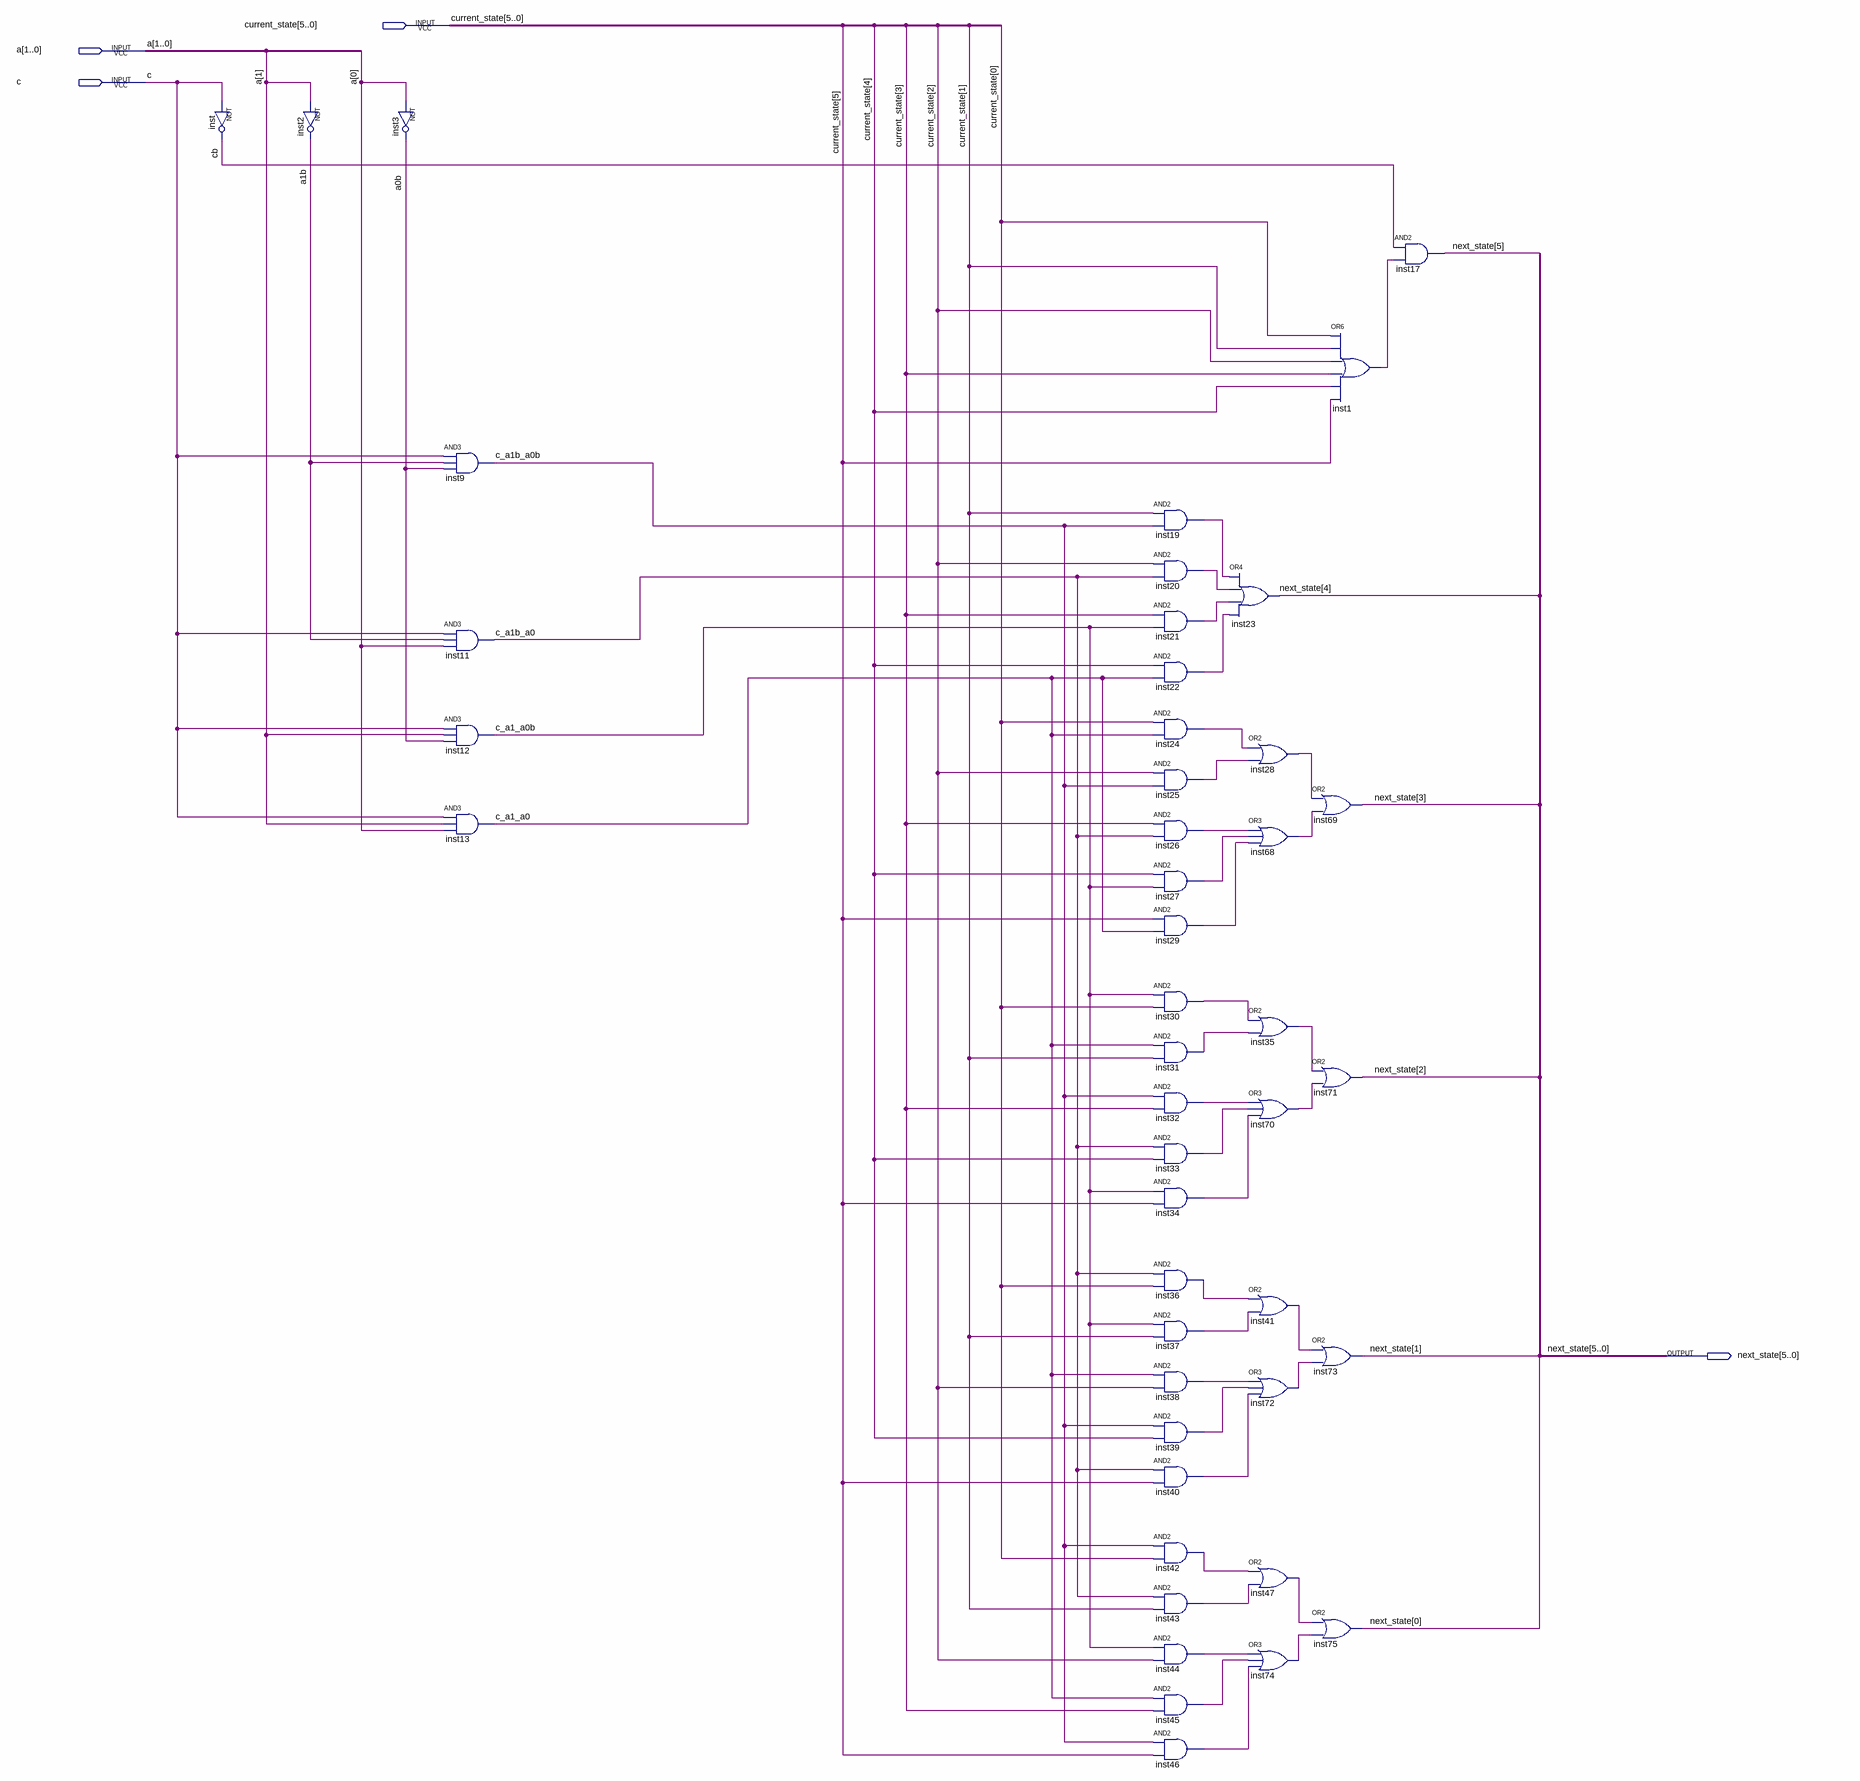
[diagram p0: schematic sheet]
// Quartus schematic Remainder_next_state_logic_mealy.bdf as structural Verilog: 46 symbols, 4 pins
module Remainder_next_state_logic_mealy (
  input  [5:0] current_state,
  input  [1:0] a,
  input  c,
  output [5:0] next_state
);

  wire a0b, a1b, c_a1_a0, c_a1_a0b, c_a1b_a0, c_a1b_a0b, cb, inst1_out, inst19_out, inst20_out, inst21_out,
       inst22_out, inst24_out, inst25_out, inst26_out, inst27_out, inst28_out, inst29_out, inst30_out,
       inst31_out, inst32_out, inst33_out, inst34_out, inst35_out, inst36_out, inst37_out, inst38_out,
       inst39_out, inst40_out, inst41_out, inst42_out, inst43_out, inst44_out, inst45_out, inst46_out,
       inst47_out, inst68_out, inst70_out, inst72_out, inst74_out;

  not inst (cb, c);
  not inst2 (a1b, a[1]);
  not inst3 (a0b, a[0]);
  and inst9 (c_a1b_a0b, c, a1b, a0b);
  and inst11 (c_a1b_a0, c, a1b, a[0]);
  and inst12 (c_a1_a0b, c, a[1], a0b);
  and inst13 (c_a1_a0, c, a[1], a[0]);
  and inst19 (inst19_out, current_state[1], c_a1b_a0b);
  and inst20 (inst20_out, current_state[2], c_a1b_a0);
  and inst21 (inst21_out, current_state[3], c_a1_a0b);
  and inst22 (inst22_out, current_state[4], c_a1_a0);
  and inst24 (inst24_out, current_state[0], c_a1_a0);
  and inst25 (inst25_out, current_state[2], c_a1b_a0b);
  and inst26 (inst26_out, current_state[3], c_a1b_a0);
  and inst27 (inst27_out, current_state[4], c_a1_a0b);
  and inst29 (inst29_out, current_state[5], c_a1_a0);
  and inst30 (inst30_out, c_a1_a0b, current_state[0]);
  and inst31 (inst31_out, c_a1_a0, current_state[1]);
  and inst32 (inst32_out, c_a1b_a0b, current_state[3]);
  and inst33 (inst33_out, c_a1b_a0, current_state[4]);
  and inst34 (inst34_out, c_a1_a0b, current_state[5]);
  and inst36 (inst36_out, c_a1b_a0, current_state[0]);
  and inst37 (inst37_out, c_a1_a0b, current_state[1]);
  and inst38 (inst38_out, c_a1_a0, current_state[2]);
  and inst39 (inst39_out, c_a1b_a0b, current_state[4]);
  and inst40 (inst40_out, c_a1b_a0, current_state[5]);
  and inst42 (inst42_out, c_a1b_a0b, current_state[0]);
  and inst43 (inst43_out, c_a1b_a0, current_state[1]);
  and inst44 (inst44_out, c_a1_a0b, current_state[2]);
  and inst45 (inst45_out, c_a1_a0, current_state[3]);
  and inst46 (inst46_out, c_a1b_a0b, current_state[5]);
  or inst23 (next_state[4], inst19_out, inst20_out, inst21_out, inst22_out);
  or inst28 (inst28_out, inst24_out, inst25_out);
  or inst68 (inst68_out, inst26_out, inst27_out, inst29_out);
  or inst35 (inst35_out, inst30_out, inst31_out);
  or inst70 (inst70_out, inst32_out, inst33_out, inst34_out);
  or inst41 (inst41_out, inst36_out, inst37_out);
  or inst72 (inst72_out, inst38_out, inst39_out, inst40_out);
  or inst47 (inst47_out, inst42_out, inst43_out);
  or inst74 (inst74_out, inst44_out, inst45_out, inst46_out);
  or inst1 (inst1_out, current_state[0], current_state[1], current_state[2], current_state[3], current_state[4], current_state[5]);
  or inst69 (next_state[3], inst28_out, inst68_out);
  or inst71 (next_state[2], inst35_out, inst70_out);
  or inst73 (next_state[1], inst41_out, inst72_out);
  or inst75 (next_state[0], inst47_out, inst74_out);
  and inst17 (next_state[5], cb, inst1_out);
endmodule
